# Altium schematic sheet ButtonPanel.SchDoc
size A3
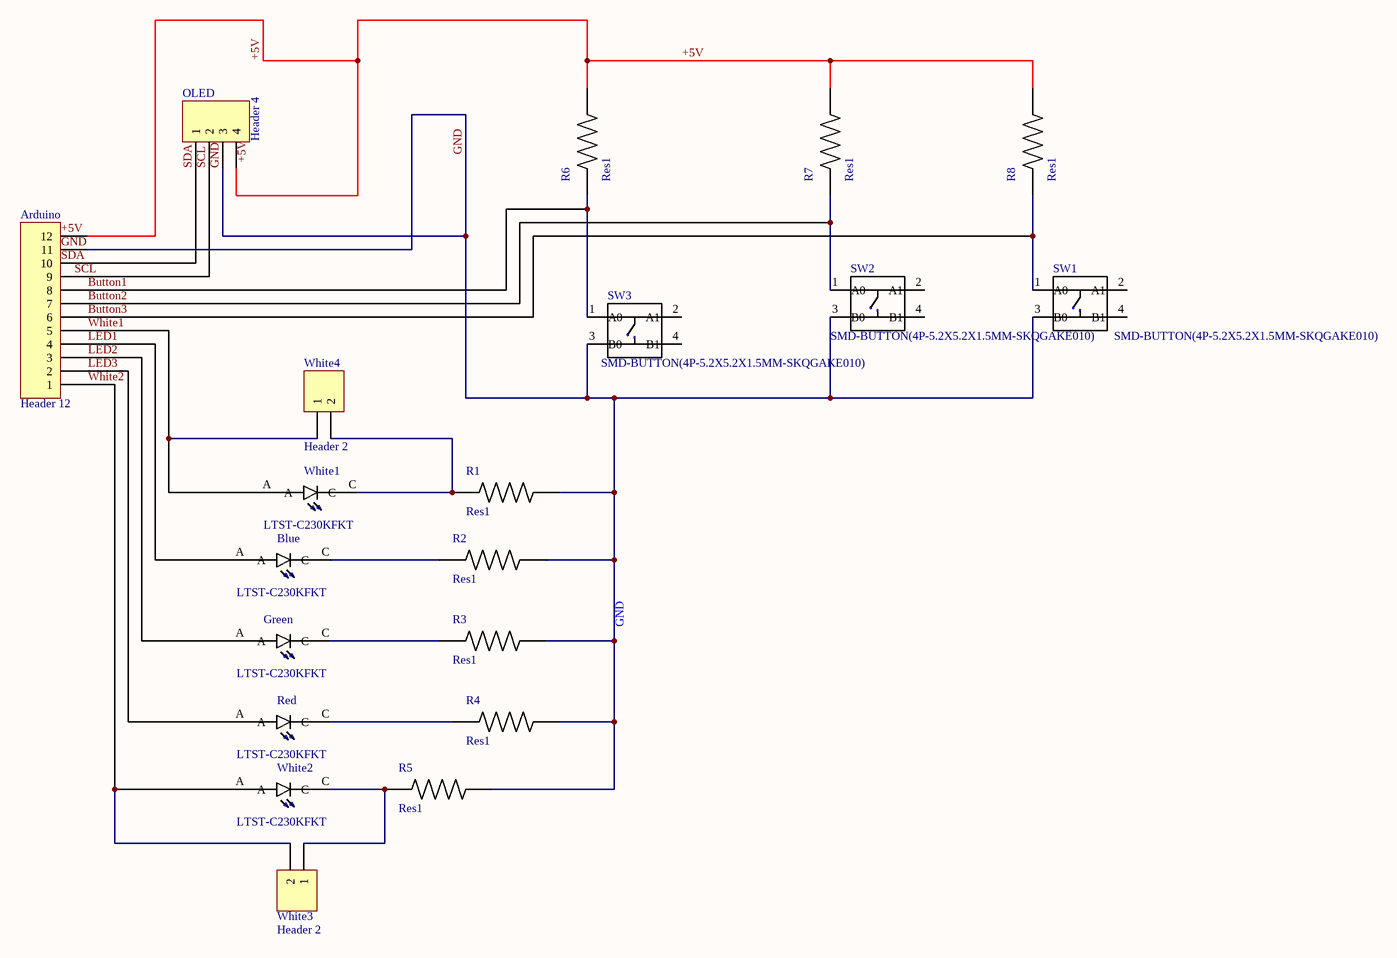
[diagram p0: ButtonPanel.SchDoc]

## Parts
Arduino  Header 12  [HDR1X12]
Blue  LTST-C230KFKT  [*LEDC3216X110_LTST-C230KFKT(Primary)]
Green  LTST-C230KFKT  [*LEDC3216X110_LTST-C230KFKT(Primary)]
OLED  Header 4  [HDR1X4]
R1  Res1  [*RESC3116X65N]
R2  Res1  [*RESC3116X65N]
R3  Res1  [*RESC3116X65N]
R4  Res1  [*RESC3116X65N]
R5  Res1  [*RESC3116X65N]
R6  Res1  [*RESC3116X65N]
R7  Res1  [*RESC3116X65N]
R8  Res1  [*RESC3116X65N]
Red  LTST-C230KFKT  [*LEDC3216X110_LTST-C230KFKT(Primary)]
SW1  SMD-BUTTON(4P-5.2X5.2X1.5MM-SKQGAKE010)  [*SW4-SMD-5.2X5.2X1.5MM]
SW2  SMD-BUTTON(4P-5.2X5.2X1.5MM-SKQGAKE010)  [*SW4-SMD-5.2X5.2X1.5MM]
SW3  SMD-BUTTON(4P-5.2X5.2X1.5MM-SKQGAKE010)  [*SW4-SMD-5.2X5.2X1.5MM]
White1  LTST-C230KFKT  [*LEDC3216X110_LTST-C230KFKT(Primary)]
White2  LTST-C230KFKT  [*LEDC3216X110_LTST-C230KFKT(Primary)]
White3  Header 2  [HDR1X2]
White4  Header 2  [HDR1X2]

## Nets
+5V: Arduino.12 OLED.4 R6.2 R7.2 R8.2
Button1: Arduino.8 R6.1 SW3.1(A0)
Button2: Arduino.7 R7.1 SW2.1(A0)
Button3: Arduino.6 R8.1 SW1.1(A0)
GND: Arduino.11 OLED.3 R1.2 R2.2 R3.2 R4.2 R5.2 SW1.3(B0) SW2.3(B0) SW3.3(B0)
LED1: Arduino.4 Blue.A
LED2: Arduino.3 Green.A
LED3: Arduino.2 Red.A
SCL: Arduino.9 OLED.2
SDA: Arduino.10 OLED.1
White1: Arduino.5 White1.A White4.1
White2: Arduino.1 White2.A White3.2
NetBlue_C: Blue.C R2.1
NetGreen_C: Green.C R3.1
NetR1_1: R1.1 White1.C White4.2
NetR4_1: R4.1 Red.C
NetR5_1: R5.1 White2.C White3.1

Not connected (* = marked no-connect by the designer): SW1 2(A1) 4(B1); SW2 2(A1) 4(B1); SW3 2(A1) 4(B1)

## Notes on the sheet
- Labels drawn without touching a wire or pin: +5V, GND, SCL, SDA

## Library data of the parts
Arduino = Header 12: Header, 12-Pin; LatestRevisionDate: 17-Jul-2002; LatestRevisionNote: Re-released for DXP Platform.; Publisher: Altium Limited
Blue Green Red White1 White2 = LTST-C230KFKT: LED; SMD; 1206; orange; 45-90mcd; 3.2x1.6x1.1mm; 130Â°; 2Ã·2.4V; 20mA; MF: Lite-On Inc.; MP: LTST-C230KFKT; Package: 1206 Lite-On; Availability: Unavailable; Price: None; SnapEDA_Link: https://www.snapeda.com/parts/LTST-C230KFKT/Lite-On%20Inc./view-part/?ref=snap; Value: *
OLED = Header 4: Header, 4-Pin; LatestRevisionDate: 17-Jul-2002; LatestRevisionNote: Re-released for DXP Platform.; Publisher: Altium Limited
R1-R5 = RT1206DRE07330RL: RES SMD 330 OHM 0.5% 1/4W 1206; MF: Yageo; Price: None; Package: 3116 Yageo; SnapEDA_Link: https://www.snapeda.com/parts/RT1206DRE07330RL/Yageo/view-part/?ref=snap; MP: RT1206DRE07330RL; Availability: Unavailable; Value: *
R6-R8 = MCA1206MD1002DP500: RES SMD 10K OHM 0.5% 0.4W 1206; MF: Vishay; Price: None; Package: 3116 Vishay; SnapEDA_Link: https://www.snapeda.com/parts/MCA1206MD1002DP500/Vishay/view-part/?ref=snap; MP: MCA1206MD1002DP500; Availability: Unavailable; Value: *
SW1-SW3 = SMD-BUTTON(4P-5.2X5.2X1.5MM-SKQGAKE010): Switch Tactile N.O. SPST Button Gull Wing 0.05A 12VDC 3.43N SMD T/R; MF: ALPS; SnapEDA_Link: https://www.snapeda.com/parts/SKQGAKE010/ALPS/view-part/?ref=snap; Availability: Unavailable; Price: None; MP: SKQGAKE010; Package: None; Value: *
White3 White4 = Header 2: Header, 2-Pin; LatestRevisionDate: 17-Jul-2002; LatestRevisionNote: Re-released for DXP Platform.; Publisher: Altium Limited